# Altium schematic sheet 4_Batteries_Monitor_and_Power_Switches.SchDoc
size 406 x 368 mm; SheetNumber: 3; SheetTotal: 9; SPICEModelCacheBZFBJVJG: <root> / <DocumentId>BZFBJVJG</DocumentId> / </root>
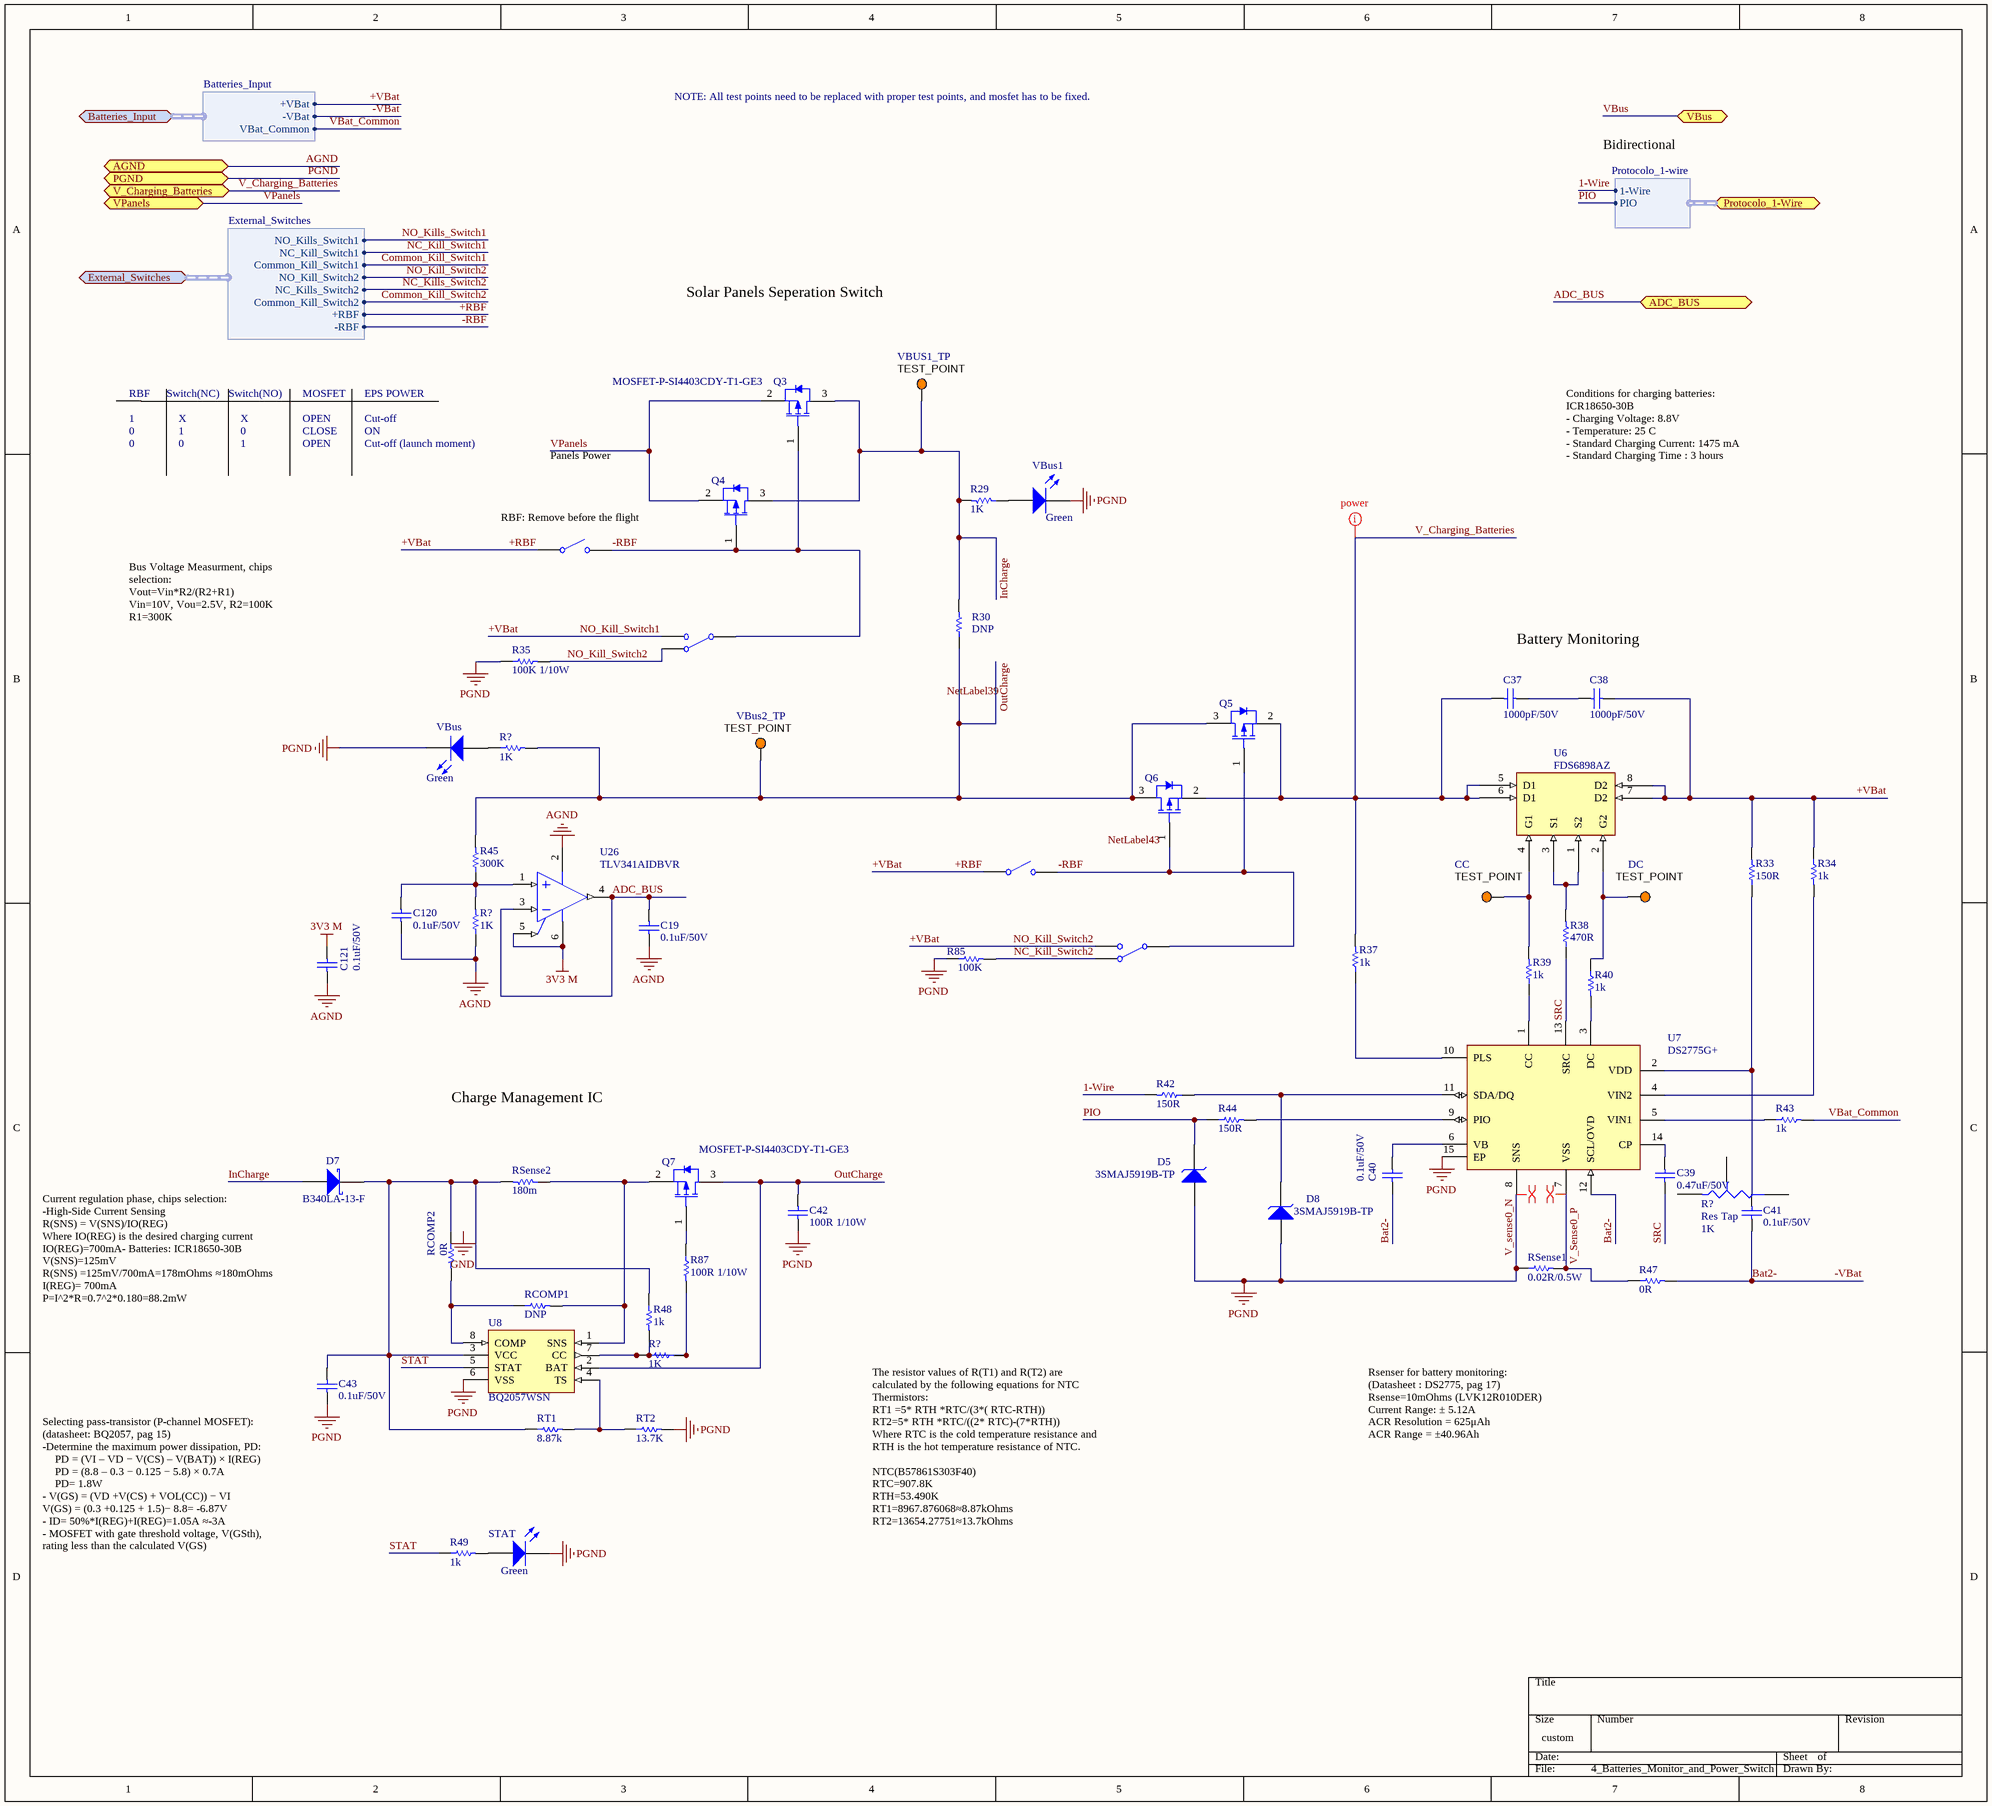
[diagram p0: 4_Batteries_Monitor_and_Power_Switches.SchDoc]

## Parts
(Parts that share a designator on the sheet are numbered #1, #2 ... from top to bottom, then left to right.)
C19  value 0.1uF/50V  (hidden comment: Capacitor)
C37  value 1000pF/50V  (hidden comment: Capacitor)
C38  value 1000pF/50V  (hidden comment: Capacitor)
C39  value 0.47uF/50V  (hidden comment: Capacitor)
C40  value 0.1uF/50V  (hidden comment: Capacitor)
C41  value 0.1uF/50V  (hidden comment: Capacitor)
C42  value 100R 1/10W  (hidden comment: Capacitor)
C43  value 0.1uF/50V  (hidden comment: Capacitor)
C120  value 0.1uF/50V  (hidden comment: Capacitor)
C121  value 0.1uF/50V  (hidden comment: Capacitor)
D5  3SMAJ5919B-TP
D7  B340LA-13-F
D8  3SMAJ5919B-TP
Q3  NCE3407A  [NCEP-SOT23-3_M]  (value not drawn)
Q4  NCE3407A  [NCEP-SOT23-3_M]  (value not drawn)
Q5  NCE3407A  [NCEP-SOT23-3_M]  (value not drawn)
Q6  NCE3407A  [NCEP-SOT23-3_M]  (value not drawn)
Q7  NCE3407A  [NCEP-SOT23-3_M]  (value not drawn)
R29  value 1K  (hidden comment: Resistor)
R30  value DNP  (hidden comment: Resistor)
R33  value 150R  (hidden comment: Resistor)
R34  value 1k  (hidden comment: Resistor)
R35  value 100K 1/10W  (hidden comment: Resistor)
R37  value 1k  (hidden comment: Resistor)
R38  value 470R  (hidden comment: Resistor)
R39  value 1k  (hidden comment: Resistor)
R40  value 1k  (hidden comment: Resistor)
R42  value 150R  (hidden comment: Resistor)
R43  value 1k  (hidden comment: Resistor)
R44  value 150R  (hidden comment: Resistor)
R45  value 300K  (hidden comment: Resistor)
R47  value 0R  (hidden comment: Resistor)
R48  value 1k  (hidden comment: Resistor)
R49  value 1k  (hidden comment: Resistor)
R85  value 100K  (hidden comment: Resistor)
R87  value 100R 1/10W  (hidden comment: Resistor)
R?#1  value 1K  (hidden comment: Resistor)
R?#2  value 1K  (hidden comment: Resistor)
R?#3  Res Tap  value 1K  [VR3]
R?#4  value 1K  (hidden comment: Resistor)
RCOMP1  value DNP  (hidden comment: Resistor)
RCOMP2  value 0R  (hidden comment: Resistor)
RSense1  value 0.02R/0.5W  (hidden comment: Resistor)
RSense2  value 180m  (hidden comment: Resistor)
RT1  value 8.87k  (hidden comment: Resistor)
RT2  value 13.7K  (hidden comment: Resistor)
S?#1  Single-Pole, Single-Throw Switch  (value not drawn)
S?#2  Single-Pole, Double-Throw Switch  (value not drawn)
S?#3  Single-Pole, Single-Throw Switch  (value not drawn)
S?#4  Single-Pole, Double-Throw Switch  (value not drawn)
STAT  Green
TEST_POINT#1  5003  [KSTN-5003]  (value not drawn)
TEST_POINT#2  5003  [KSTN-5003]  (value not drawn)
TEST_POINT#3  5003  [KSTN-5003]  (value not drawn)
TEST_POINT#4  5003  [KSTN-5003]  (value not drawn)
U6  FDS6898AZ
U7  DS2775G+  [FP-T1435N-1-IPC_C]
U8  BQ2057WSN  [D0008A_L]
U26  TLV341AIDBVR  [DBV0006A_L]
VBus  Light-Emitting Diode  (value not drawn)
VBus1  Light-Emitting Diode  (value not drawn)

## Ports
ADC_BUS (bidir), AGND (bidir), Batteries_Input (bidir, harness Batteries_Input), External_Switches (bidir, harness External_Switches), PGND (bidir), Protocolo_1-Wire (bidir, harness Protocolo_1-wire), V_Charging_Batteries (bidir), VBus (bidir), VPanels (bidir)

## Harnesses
Batteries_Input: +VBat, -VBat, VBat_Common
External_Switches: NO_Kills_Switch1, NC_Kill_Switch1, Common_Kill_Switch1, NO_Kill_Switch2, NC_Kills_Switch2, Common_Kill_Switch2, +RBF, -RBF
Protocolo_1-wire: 1-Wire, PIO

## Nets
3V3 M: C121.2 U26.5(~{SHDN}) U26.6(V+)
AGND: C19.1 C120.1 C121.1 R?#2.1 U26.2(GND) ; port AGND
PGND: C42.2 C43.2 D5.1(A) D8.1(A) R35.1 R85.1 RSense1.1 RT2.2 STAT.2(K) U7.8(SNS) U7.15(EP) U8.6(VSS) VBus.2(K) VBus1.2(K) ; port PGND  [also labelled V_sense0_N]
1-Wire: R42.2 ; port Protocolo_1-Wire.1-Wire
+RBF: C38.2 R33.2 R34.1 R35.2 S?#1.1 S?#2.2 S?#2.3 S?#3.1 S?#4.2 U6.7(D2) U6.8(D2) ; port Batteries_Input.+VBat, port External_Switches.NO_Kill_Switch2, port External_Switches.+RBF  [also labelled +VBat, NO_Kill_Switch1, NO_Kill_Switch2]
-RBF: Q3.1(GATE) Q4.1(GATE) Q5.1(GATE) Q6.1(GATE) S?#1.2 S?#2.1 S?#3.2 S?#4.1 ; port External_Switches.-RBF
-VBat: C40.1 C41.2 R47.2 U7.12(SCL/OVD) ; port Batteries_Input.-VBat  [also labelled Bat2-]
ADC_BUS: C19.2 U26.3(IN-) U26.4(OUT) ; port ADC_BUS
Common_Kill_Switch1: port External_Switches.Common_Kill_Switch1
Common_Kill_Switch2: port External_Switches.Common_Kill_Switch2
InCharge: D7.1(A) Q3.3(DRAIN) Q4.3(DRAIN) R29.2 R30.2 TEST_POINT#1.1
NC_Kill_Switch1: port External_Switches.NC_Kill_Switch1
NC_Kill_Switch2: R85.2 S?#4.3
NC_Kills_Switch2: port External_Switches.NC_Kills_Switch2
NO_Kills_Switch1: port External_Switches.NO_Kills_Switch1
OutCharge: C42.1 Q5.3(DRAIN) Q6.3(DRAIN) Q7.3(DRAIN) R30.1 R45.2 R?#1.2 TEST_POINT#2.1 U8.2(BAT)
PIO: D5.2(K) R44.1 ; port Protocolo_1-Wire.PIO
SRC: C39.1 R38.1 U7.13(SRC)
STAT: R49.1 U8.5(STAT)
V_Charging_Batteries: C37.1 Q5.2(SOURCE) Q6.2(SOURCE) R37.2 U6.5(D1) U6.6(D1) ; port V_Charging_Batteries
V_Sense0_P: R47.1 RSense1.2 U7.7(VSS)
VBat_Common: R43.2 ; port Batteries_Input.VBat_Common
VBus: port VBus
VPanels: Q3.2(SOURCE) Q4.2(SOURCE) ; port VPanels
NetC37_2: C37.2 C38.1
NetC39_2: C39.2 U7.14(CP)
NetC40_2: C40.2 U7.6(VB)
NetC41_1: C41.1 R33.1 U7.2(VDD)
NetC43_1: C43.1 D7.2(K) R48.1 RCOMP2.1 RSense2.2 RT1.1 U8.3(VCC)
NetC120_2: C120.2 R45.1 R?#2.2 U26.1(IN+)
NetD8_2: D8.2(K) R42.1 U7.11(SDA/DQ)
NetQ7_1: Q7.1(GATE) R87.1
NetQ7_2: Q7.2(SOURCE) RCOMP1.2 RSense2.1 U8.1(SNS)
NetR29_1: R29.1 VBus1.1(A)
NetR34_2: R34.2 U7.4(VIN2)
NetR37_1: R37.1 U7.10(PLS)
NetR38_2: R38.2 U6.1(S2) U6.3(S1)
NetR39_1: R39.1 U7.1(CC)
NetR39_2: R39.2 TEST_POINT#3.1 U6.4(G1)
NetR40_1: R40.1 TEST_POINT#4.1 U6.2(G2)
NetR40_2: R40.2 U7.3(DC)
NetR43_1: R43.1 U7.5(VIN1)
NetR44_2: R44.2 U7.9(PIO)
NetR48_2: R48.2 R87.2 R?#4.1 R?#4.2 U8.7(CC)
NetR49_2: R49.2 STAT.1(A)
NetR?#1_1: R?#1.1 VBus.1(A)
NetRCOMP1_1: RCOMP1.1 RCOMP2.2 U8.8(COMP)
NetRT1_2: RT1.2 RT2.1 U8.4(TS)

Not connected (* = marked no-connect by the designer): R?#3 1(A) 2(B) 3(TAP)

## Layout directives
mark named power: V_Charging_Batteries
differential pair: PGND, V_Sense0_P

## Notes on the sheet
- NOTE: All test points need to be replaced with proper test points, and mosfet has to be fixed.
- Bidirectional
- Solar Panels Seperation Switch
- RBF
- Switch(NC)
- Switch(NO)
- MOSFET
- EPS POWER
- (near Q3) MOSFET-P-SI4403CDY-T1-GE3
- (near TEST_POINT#1) VBUS1_TP
- Conditions for charging batteries:
- 1
- 0
- X
- OPEN
- CLOSE
- Cut-off
- ON
- Cut-off (launch moment)
- Panels Power
- ICR18650-30B
- - Charging Voltage: 8.8V
- - Temperature: 25 C
- - Standard Charging Current: 1475 mA
- - Standard Charging Time : 3 hours
- (near S?#1) RBF: Remove before the flight
- (near VBus1) Green
- Bus Voltage Measurment, chips
- selection:
- Vout=Vin*R2/(R2+R1)
- Vin=10V, Vou=2.5V, R2=100K
- R1=300K
- Battery Monitoring
- (near TEST_POINT#2) VBus2_TP
- (near VBus) Green
- CC
- DC
- Charge Management IC
- Current regulation phase, chips selection:
- (near Q7) MOSFET-P-SI4403CDY-T1-GE3
- -High-Side Current Sensing
- R(SNS) = V(SNS)/IO(REG)
- Where IO(REG) is the desired charging current
- IO(REG)=700mA- Batteries: ICR18650-30B
- V(SNS)=125mV
- R(SNS) =125mV/700mA=178mOhms ≈180mOhms
- I(REG)= 700mA
- P=I^2*R=0.7^2*0.180=88.2mW
- The resistor values of R(T1) and R(T2) are
- calculated by the following equations for NTC
- Rsenser for battery monitoring:
- (Datasheet : DS2775, pag 17)
- (near C43) Selecting pass-transistor (P-channel MOSFET):
- (datasheet: BQ2057, pag 15)
- -Determine the maximum power dissipation, PD:
- Thermistors:
- RT1 =5* RTH *RTC/(3*( RTC-RTH))
- RT2=5* RTH *RTC/((2* RTC)-(7*RTH))
- Where RTC is the cold temperature resistance and
- RTH is the hot temperature resistance of NTC.
- Rsense=10mOhms (LVK12R010DER)
- Current Range: ± 5.12A
- ACR Resolution = 625μAh
- ACR Range = ±40.96Ah
- - V(GS) = (VD +V(CS) + VOL(CC)) − VI
- V(GS) = (0.3 +0.125 + 1.5)− 8.8= -6.87V
- PD = (VI – VD − V(CS) – V(BAT)) × I(REG)
- PD = (8.8 – 0.3 − 0.125 − 5.8) × 0.7A
- PD= 1.8W
- NTC(B57861S303F40)
- RTC=907.8K
- RTH=53.490K
- RT1=8967.876068≈8.87kOhms
- - ID= 50%*I(REG)+I(REG)=1.05A ≈-3A
- - MOSFET with gate threshold voltage, V(GSth),
- rating less than the calculated V(GS)
- RT2=13654.27751≈13.7kOhms
- Labels drawn without touching a wire or pin: GND, NetLabel39, NetLabel43

## Library data of the parts
C19 C37-C43 C120 C121 = Capacitor: SimulationGenericComponent: True
D5 D8 = Suppressor Single: AF: 1; BV: 0; BV_MAX: 1e99; EG: 1.11; FC: 0.5; IBV: 0.001; IS: 1e-14; MJSW: 0.33; NTUN: 30; TNOM: 27; XTI: 3; SimulationGenericComponent: True; CJO: 0; CJP: 0; CTA: 0; CTP: 0; FCS: 0.5; FV_MAX: 1e99; IKF: 0; IKR: 0; ISR: 1e-14; JSW: 0; JTUN: 0; JTUNSW: 0; KEG: 1; KF: 0; LEVEL: 1; N: 1; NBV: 1; NR: 1; NS: 1; PHP: 1; RS: 0; TCV: 0; TLEV: 0; TLEVC: 0; TM1: 0; TM2: 0; TPB: 0; TPHP: 0; TRS: 0; TRS2: 0; TT: 0; TTT1: 0; TTT2: 0; VJ: 1; XTITUN: 3
D7 = Shottky Diode: AF: 1; BV: 0; BV_MAX: 1e99; EG: 1.11; FC: 0.5; IBV: 0.001; IS: 1e-14; MJSW: 0.33; NTUN: 30; TNOM: 27; XTI: 3; SimulationGenericComponent: True; CJO: 0; CJP: 0; CTA: 0; CTP: 0; FCS: 0.5; FV_MAX: 1e99; IKF: 0; IKR: 0; ISR: 1e-14; JSW: 0; JTUN: 0; JTUNSW: 0; KEG: 1; KF: 0; LEVEL: 1; N: 1; NBV: 1; NR: 1; NS: 1; PHP: 1; RS: 0; TCV: 0; TLEV: 0; TLEVC: 0; TM1: 0; TM2: 0; TPB: 0; TPHP: 0; TRS: 0; TRS2: 0; TT: 0; TTT1: 0; TTT2: 0; VJ: 1; XTITUN: 3
Q3-Q7 = CMP-013-00018-3: P-Channel Enhancement Mode Power MOSFET, 30 V, 4.3 A, - 55 to 150 degC, 3-Pin SOT23, RoHS, Tape and Reel; Manufacturer: NCE Power; Datasheet Version: Rev. 1.1, 07/2014; Case/Package: SOT23-3; Mounting Technology: SM; Datasheet URL: http://www.ncepower.com/Upload/MOSFET/mos1/55vpmos/NCE3407Adatasheet-17275285683.pdf; Package Reference: SOT23-3; Package Description: 3-Pin Small Outline Transistor, Body 2.9 x 1.3 mm, Pitch 0.95 mm; RoHS Compliant: Unknown
R29 R30 R33-R35 R37-R40 R42-R45 R47-R49 R85 R87 R?#1 R?#2 R?#4 RCOMP1 RCOMP2 RSense1 RSense2 RT1 RT2 = Resistor: TC1: 0; SimulationGenericComponent: True; TC2: 0
R?#3 = Res Tap: Tapped Resistor; Sim Note: Enter the Resistance value and the set point into parameter fields.; Set Position: 0.5; Published: 24-Mar-1999; LatestRevisionDate: 17-Jul-2002; LatestRevisionNote: Re-released for DXP Platform.; PackageReference: VR3; Publisher: Altium Limited; PackageDescription: Variable Resistor, Thru-Hole; 3 Leads
S?#1 S?#3 = SPST SW: closed: 0; Rclosed: 1m; Ropen: 1Meg; SimulationGenericComponent: True
S?#2 S?#4 = SPDT SW: nodeUP_closed: 1; Rclosed: 1m; Ropen: 1Meg; SimulationGenericComponent: True
STAT = LED: Light-Emitting Diode; AF: 1; BV: 0; BV_MAX: 1e99; EG: 1.11; FC: 0.5; IBV: 0.001; IS: 1e-14; MJSW: 0.33; NTUN: 30; TNOM: 27; XTI: 3; SimulationGenericComponent: True; CJO: 0; CJP: 0; CTA: 0; CTP: 0; FCS: 0.5; FV_MAX: 1e99; IKF: 0; IKR: 0; ISR: 1e-14; JSW: 0; JTUN: 0; JTUNSW: 0; KEG: 1; KF: 0; LEVEL: 1; N: 1; NBV: 1; NR: 1; NS: 1; PHP: 1; RS: 0; TCV: 0; TLEV: 0; TLEVC: 0; TM1: 0; TM2: 0; TPB: 0; TPHP: 0; TRS: 0; TRS2: 0; TT: 0; TTT1: 0; TTT2: 0; VJ: 1; XTITUN: 3
TEST_POINT#1-TEST_POINT#4 = CMP-002-00037-2: Test Point, Orange, Height 4.6 mm, Tail Length 3 mm, 1-Pin THD, RoHS; Manufacturer: Keystone; Colour: Orange; Packaging: Bulk; Package Description: 1-Pin Through Hole Device, Dia 2.54 mm; Pins: 1; Package Reference: 5003; Datasheet Version: Jun-15; Case/Package: 5003; Mounting Technology: TH; Connector Type: TestPoint; Diameter: 2.54mm; Contact Material: Bronze; Datasheet URL: http://keyelco.com/userAssets/file/M65p56.pdf; Manufacturer URL: http://www.keyelco.com/; Package Quantity: 10; Contact Plating: Tin; RoHS Compliant: True
U6 = CMP-013-00034-1: Dual N-Channel Logic Level PWM Optimized PowerTrench® MOSFET 20V, 9.4A, 14mΩ
U7 = CMP-00000-1: Fuel Gauge Li-Ion/Li-Pol Serial 1-Wire 4mA 0.4V 14-Pin TDFN-EP Tube; Operating Supply Current: 80uA; Output Voltage: 4.7V; Min Supply Voltage: 4V; Number of Cells: 2; Fault Protection: Over Current,Over Voltage; Max Supply Voltage: 9.2V; Interface: 1-WIRE,Serial; Min Operating Temperature: -20°C; Max Operating Temperature: 70°C; RoHS Compliant: Yes; Radiation Hardening: No; Case/Package: DFN; Mounting Technology: Surface Mount; Series: -; Packaging: Rail/Tube; Package Quantity: 60; Pins: 14
U8 = CMP-001-0000-1: Linear Battery Charger Li-Ion/Li-Pol 2000mA 8.4V 8-Pin SOIC Tube
U26 = CMP-0017-00695-2: Low-Voltage, Rail-To-Rail Output CMOS Operational Amplifier with Shutdown, 1.5 to 5.5 V, -40 to 125 degC, 6-pin SOT23 (DBV6), Green (RoHS & no Sb/Br); Manufacturer: Texas Instruments; GBW(Typ)(MHz): 2.2; IIB(Max)(pA): 3000; CMRR(Min)(dB): 50; Vn at 1kHz(Typ)(nV/rtHz): 33; Iq per channel(Max)(mA): 0.15; Number of Channels: 1; Total Supply Voltage(Min)(+5V is 5, +/-5V is 10): 1.5; Rating: Catalog; Slew Rate(Typ)(V/us): 0.9; Sub Family: General Purpose Amplifier, Low Power Amp (<=500uA), Low Supply Voltage Amplifier (<=2.7V); Total Supply Voltage(Max)(+5V is 5, +/-5V is 10): 5.5; Offset Drift(Typ)(uV/C): 1.9; Vio (25C)(Max)(mV): 1.25; ComponentLink1URL: http://www.ti.com/; ComponentLink3Description: Package Specification; Code_JEDEC: MO-178; Mounting Technology: Surface Mount; DatasheetVersion: SLVS568C; PartNumber: TLV341AIDBVR; PackageDescription: 6-Pin Plastic Small Outline, Body 1.6 x 2.9 mm, Pitch 0.95 mm; PackageReference: DBV0006A; Eco-Plan: Green (RoHS & no Sb/Br); ComponentLink3URL: http://www.ti.com/litv/pdf/mpds026h; PackageVersion: 4073253-5/K, 03/2006; ComponentLink2Description: Datasheet; ComponentLink2URL: http://www.ti.com/lit/ds/symlink/tlv341a.pdf; ComponentLink1Description: Manufacturer URL
VBus VBus1 = LED: AF: 1; BV: 0; BV_MAX: 1e99; EG: 1.11; FC: 0.5; IBV: 0.001; IS: 1e-14; MJSW: 0.33; NTUN: 30; TNOM: 27; XTI: 3; SimulationGenericComponent: True; CJO: 0; CJP: 0; CTA: 0; CTP: 0; FCS: 0.5; FV_MAX: 1e99; IKF: 0; IKR: 0; ISR: 1e-14; JSW: 0; JTUN: 0; JTUNSW: 0; KEG: 1; KF: 0; LEVEL: 1; N: 1; NBV: 1; NR: 1; NS: 1; PHP: 1; RS: 0; TCV: 0; TLEV: 0; TLEVC: 0; TM1: 0; TM2: 0; TPB: 0; TPHP: 0; TRS: 0; TRS2: 0; TT: 0; TTT1: 0; TTT2: 0; VJ: 1; XTITUN: 3